# Altium project SHT20 Mod.PrjPcb
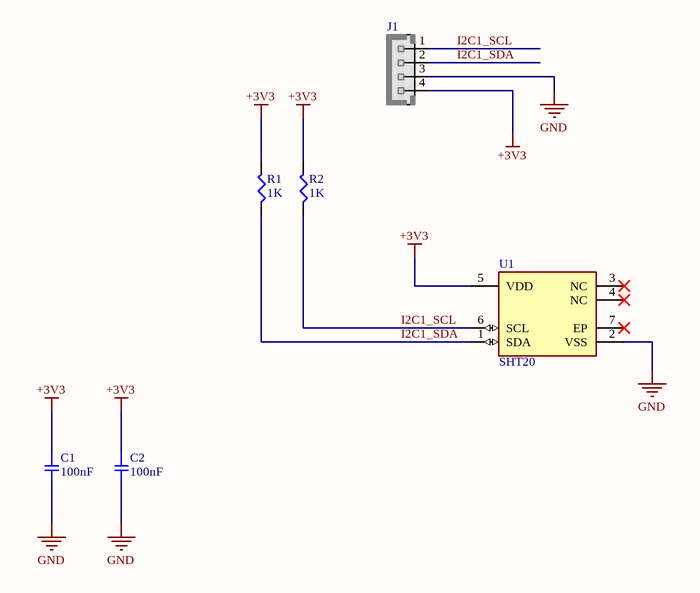
[diagram p0: SHT20.SchDoc]
1 sheet, 6 parts. Net scope: global (net labels, ports and power ports of the same name join across sheets).
Board file: SHT20.PcbDoc

## Sheet SHT20.SchDoc
size A; SheetNumber: 1; SheetTotal: 1

### Parts
C1  100nF  [SMD-0805C]
C2  100nF  [SMD-0805C]
J1  SHT20 Mod  [XH_4]  (value not drawn)
R1  1K  [SMD-0805-RES]
R2  1K  [SMD-0805-RES]
U1  SHT20  [FP-SHT20-MFG]

### Nets
+3V3: C1.1 C2.1 J1.4 R1.2 R2.2 U1.5(VDD)
GND: C1.2 C2.2 J1.3 U1.2(VSS)
I2C1_SCL: J1.1 R2.1 U1.6(SCL)
I2C1_SDA: J1.2 R1.1 U1.1(SDA)

Not connected (* = marked no-connect by the designer): U1 3(NC)* 4(NC)* 7(EP)*

### Library data of the parts
C1 C2 = GC321AD72E103KX01D: CAP CER 100nF 50V X7R 0805; Manufacturer: Murata Electronics North America; Factory Stock: 0; Unit Price (USD): 0.3; Minimum Quantity: 1; Value: 10000pF; Tolerance: ±10%; Voltage: 250V; Temperature Coefficient: X7T; Datasheets: http://search.murata.co.jp/Ceramy/image/img/A01X/G101/ENG/GC321AD72E103KX01-01.pdf; Image: //media.digikey.com/Renders/Murata%20Renders/0805(GC3)200x125.jpg; Digi-Key Part Number: 490-13986-1-ND; Part Number: GC321AD72E103KX01D; Quantity Available: 4000; @ qty: 0; Packaging: Cut Tape (CT); Series: GC3; Part Status: Active; Operating Temperature: -55°C ~ 125°C; Features: -; Ratings: AEC-Q200; Applications: Automotive; Mounting Type: Surface Mount, MLCC; Package / Case: 0805 (2012 Metric); Size / Dimension: 0.079" L x 0.049" W (2.00mm x 1.25mm); Height - Seated (Max): -; Thickness (Max): 0.039" (1.00mm); Lead Spacing: -; Lead Style: -
J1 = XH_4: JST-XH pitch: 2.5mm; VALUE: HHDR_4
R1 R2 = ERJ-6BQF1R0V: 1KΩ 0805; Manufacturer: Panasonic Electronic Components; Factory Stock: 0; Unit Price (USD): 0.05834; @ qty: 1500; Minimum Quantity: 1; Value: 1; Tolerance: ±1%; Power (Watts): 0.333W, 1/3W; Temperature Coefficient: ±200ppm/°C; Part Number: ERJ-6BQF1R0V; Datasheets: https://industrial.panasonic.com/cdbs/www-data/pdf/RDA0000/AOA0000C239.pdf; Image: //media.digikey.com/Renders/Panasonic%20Renders/ERJ-0805%20Pkg.jpg; Digi-Key Part Number: P17499CT-ND; Quantity Available: 808; Packaging: Cut Tape (CT); Series: ERJ; Part Status: Active; Composition: Thick Film; Features: Automotive AEC-Q200, Current Sense; Operating Temperature: -55°C ~ 125°C; Package / Case: 0805 (2012 Metric); Supplier Device Package: 0805; Size / Dimension: 0.079" L x 0.049" W (2.00mm x 1.25mm); Height - Seated (Max): 0.028" (0.70mm); Number of Terminations: 2; Failure Rate: -
U1 = CMP-2000-05344-2: SENSOR HUMID/TEMP 3V I2C 3% SMD; Manufacturer: Sensirion; Min Supply Voltage: 2.1V; Automotive Grade: Grade 1; Max Supply Voltage: 3.6V; Operating Supply Current: 300uA; Resolution: 14bits; Device Class L2: Temperature and Humidity Sensors; Ipc Land Pattern Name: DFN300X300X110-6; Category: IC; Device Class L3: unset; Accuracy: 3%; ComponentLink2URL: https://www.sensirion.com/fileadmin/user_upload/customers/sensirion/Dokumente/0_Datasheets/Humidity/Sensirion_Humidity_Sensors_SHT20_Datasheet.pdf; Temperature: -40°C to +125°C; Interface: I2C; Lead Free: Yes; Temperature Range High: +125°C; Automotive: Yes; Device Class L1: Sensors; Height: 1.1mm; Temperature Range Low: -40°C; ComponentLink2Description: Datasheet; Octopart: https://octopart.com/sht20-sensirion-47077745; Sensor Output: I2C; Manufacturer Part Number: SHT20; Package: 0; Digikey Description: SENSOR HUMID/TEMP 3V I2C 3% SMD; RoHS: TRUE